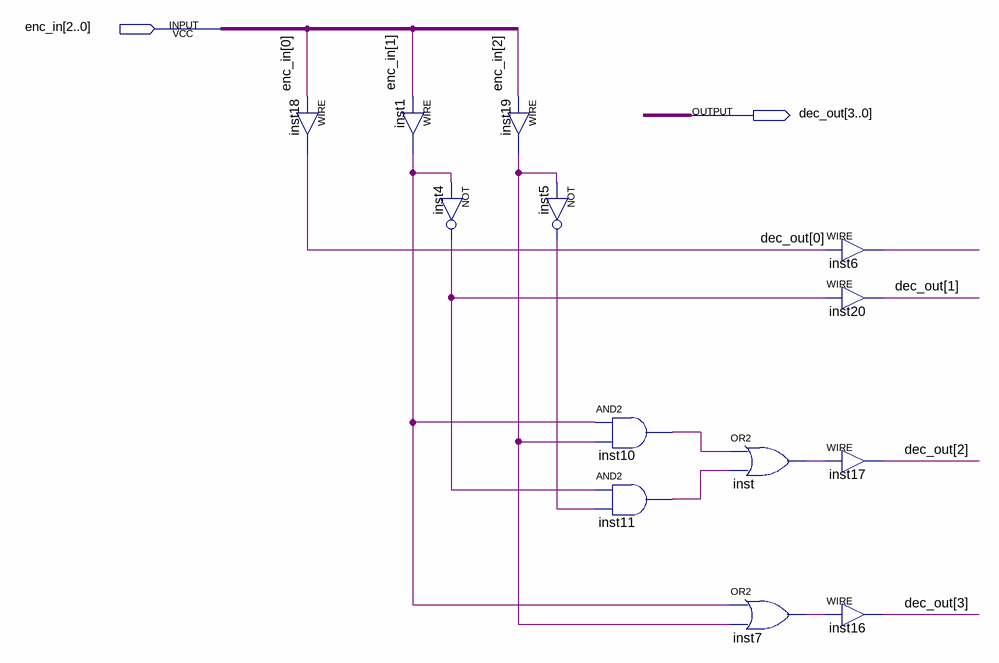
[diagram p0: schematic sheet]
// Quartus schematic sop.bdf as structural Verilog: 13 symbols, 2 pins
module sop (
  input  [2:0] enc_in,
  output [3:0] dec_out
);

  wire inst1_out, inst4_out, inst5_out, inst6_out, inst7_out, inst10_out, inst11_out, inst19_out, inst_out;

  assign dec_out[0] = enc_in[0];  // WIRE inst18
  assign inst1_out = enc_in[1];  // WIRE inst1
  not inst4 (inst4_out, inst1_out);
  assign inst19_out = enc_in[2];  // WIRE inst19
  not inst5 (inst5_out, inst19_out);
  and inst10 (inst10_out, inst1_out, inst19_out);
  and inst11 (inst11_out, inst4_out, inst5_out);
  or inst (inst_out, inst10_out, inst11_out);
  or inst7 (inst7_out, inst1_out, inst19_out);
  assign inst6_out = dec_out[0];  // WIRE inst6
  assign dec_out[1] = inst4_out;  // WIRE inst20
  assign dec_out[2] = inst_out;  // WIRE inst17
  assign dec_out[3] = inst7_out;  // WIRE inst16
endmodule
